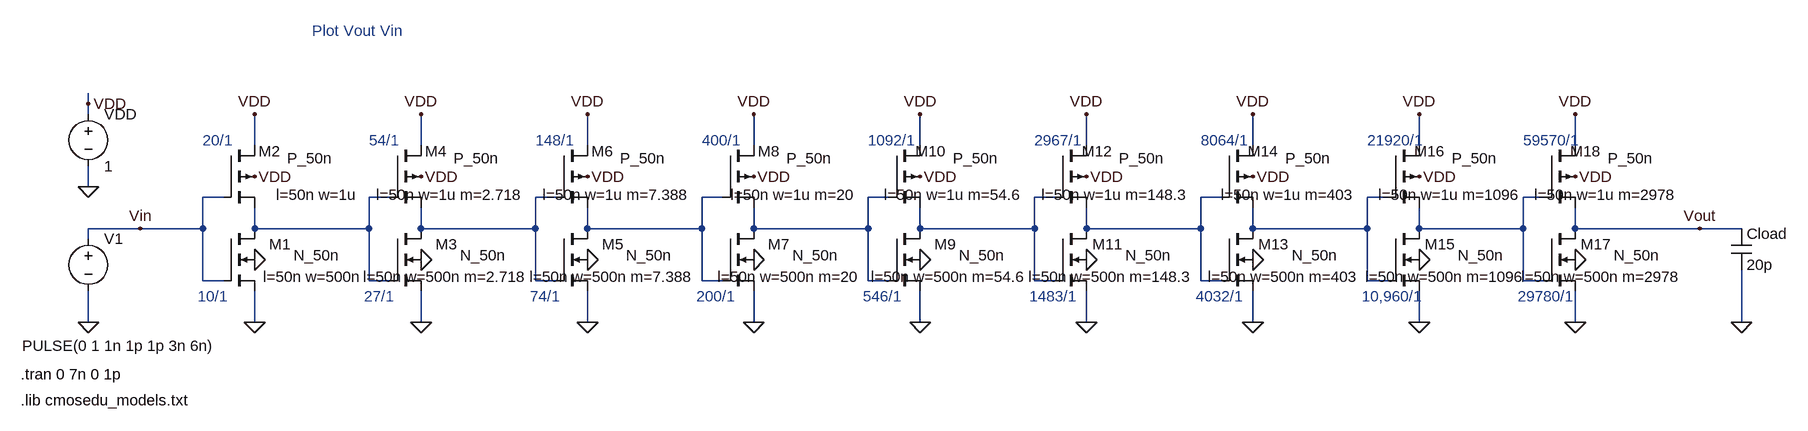
[diagram p0: schematic Fig11_20.asc]
Fig11_20.asc, the LTspice schematic file:
Version 4
SHEET 1 3172 680
WIRE 192 -368 192 -384
WIRE 192 -352 192 -368
WIRE 192 -240 192 -272
WIRE 192 -160 192 -176
WIRE 192 -32 192 -80
WIRE 272 -176 192 -176
WIRE 368 -176 272 -176
WIRE 368 -176 368 -224
WIRE 368 -96 368 -176
WIRE 400 -224 368 -224
WIRE 400 -96 368 -96
WIRE 448 -304 448 -352
WIRE 448 -176 448 -208
WIRE 448 -32 448 -80
WIRE 624 -176 448 -176
WIRE 624 -176 624 -224
WIRE 624 -96 624 -176
WIRE 656 -224 624 -224
WIRE 656 -96 624 -96
WIRE 704 -304 704 -352
WIRE 704 -176 704 -208
WIRE 704 -32 704 -80
WIRE 880 -176 704 -176
WIRE 880 -176 880 -224
WIRE 880 -96 880 -176
WIRE 912 -224 880 -224
WIRE 912 -96 880 -96
WIRE 960 -304 960 -352
WIRE 960 -176 960 -208
WIRE 960 -32 960 -80
WIRE 1136 -176 960 -176
WIRE 1136 -176 1136 -224
WIRE 1136 -96 1136 -176
WIRE 1168 -224 1136 -224
WIRE 1168 -96 1136 -96
WIRE 1216 -304 1216 -352
WIRE 1216 -176 1216 -208
WIRE 1216 -32 1216 -80
WIRE 1392 -176 1216 -176
WIRE 1392 -176 1392 -224
WIRE 1392 -96 1392 -176
WIRE 1424 -224 1392 -224
WIRE 1424 -96 1392 -96
WIRE 1472 -304 1472 -352
WIRE 1472 -176 1472 -208
WIRE 1472 -32 1472 -80
WIRE 1648 -176 1472 -176
WIRE 1648 -176 1648 -224
WIRE 1648 -96 1648 -176
WIRE 1680 -224 1648 -224
WIRE 1680 -96 1648 -96
WIRE 1728 -304 1728 -352
WIRE 1728 -176 1728 -208
WIRE 1728 -32 1728 -80
WIRE 1904 -176 1728 -176
WIRE 1904 -176 1904 -224
WIRE 1904 -96 1904 -176
WIRE 1936 -224 1904 -224
WIRE 1936 -96 1904 -96
WIRE 1984 -304 1984 -352
WIRE 1984 -176 1984 -208
WIRE 1984 -32 1984 -80
WIRE 2160 -176 1984 -176
WIRE 2160 -176 2160 -224
WIRE 2160 -96 2160 -176
WIRE 2192 -224 2160 -224
WIRE 2192 -96 2160 -96
WIRE 2240 -304 2240 -352
WIRE 2240 -176 2240 -208
WIRE 2240 -32 2240 -80
WIRE 2400 -176 2240 -176
WIRE 2400 -176 2400 -224
WIRE 2400 -96 2400 -176
WIRE 2432 -224 2400 -224
WIRE 2432 -96 2400 -96
WIRE 2480 -304 2480 -352
WIRE 2480 -176 2480 -208
WIRE 2480 -32 2480 -80
WIRE 2672 -176 2480 -176
WIRE 2736 -176 2672 -176
WIRE 2736 -32 2736 -112
FLAG 448 -128 0
FLAG 192 -240 0
FLAG 192 -368 VDD
FLAG 448 -256 VDD
FLAG 448 -32 0
FLAG 448 -352 VDD
FLAG 704 -128 0
FLAG 704 -256 VDD
FLAG 704 -32 0
FLAG 704 -352 VDD
FLAG 960 -128 0
FLAG 960 -256 VDD
FLAG 960 -32 0
FLAG 960 -352 VDD
FLAG 1216 -128 0
FLAG 1216 -256 VDD
FLAG 1216 -32 0
FLAG 1216 -352 VDD
FLAG 1472 -128 0
FLAG 1472 -256 VDD
FLAG 1472 -32 0
FLAG 1472 -352 VDD
FLAG 1728 -128 0
FLAG 1728 -256 VDD
FLAG 1728 -32 0
FLAG 1728 -352 VDD
FLAG 1984 -128 0
FLAG 1984 -256 VDD
FLAG 1984 -32 0
FLAG 1984 -352 VDD
FLAG 2240 -128 0
FLAG 2240 -256 VDD
FLAG 2240 -32 0
FLAG 2240 -352 VDD
FLAG 2480 -128 0
FLAG 2480 -256 VDD
FLAG 2480 -32 0
FLAG 2480 -352 VDD
FLAG 2736 -32 0
FLAG 192 -32 0
FLAG 2672 -176 Vout
FLAG 272 -176 Vin
SYMBOL nmos4 400 -176 R0
WINDOW 0 104 24 Right 0
WINDOW 3 179 41 Right 0
WINDOW 123 213 74 Right 0
SYMATTR InstName M1
SYMATTR Value N_50n
SYMATTR Value2 l=50n w=500n
SYMBOL voltage 192 -368 R0
WINDOW 123 0 0 Left 0
WINDOW 39 0 0 Left 0
SYMATTR InstName VDD
SYMATTR Value 1
SYMBOL pmos4 400 -304 R0
WINDOW 0 88 9 Right 0
WINDOW 3 168 20 Right 0
WINDOW 123 206 76 Right 0
SYMATTR InstName M2
SYMATTR Value P_50n
SYMATTR Value2 l=50n w=1u
SYMBOL nmos4 656 -176 R0
WINDOW 0 104 24 Right 0
WINDOW 3 179 41 Right 0
WINDOW 123 213 74 Right 0
SYMATTR InstName M3
SYMATTR Value N_50n
SYMATTR Value2 l=50n w=500n m=2.718
SYMBOL pmos4 656 -304 R0
WINDOW 0 88 9 Right 0
WINDOW 3 168 20 Right 0
WINDOW 123 206 76 Right 0
SYMATTR InstName M4
SYMATTR Value P_50n
SYMATTR Value2 l=50n w=1u m=2.718
SYMBOL nmos4 912 -176 R0
WINDOW 0 104 24 Right 0
WINDOW 3 179 41 Right 0
WINDOW 123 213 74 Right 0
SYMATTR InstName M5
SYMATTR Value N_50n
SYMATTR Value2 l=50n w=500n m=7.388
SYMBOL pmos4 912 -304 R0
WINDOW 0 88 9 Right 0
WINDOW 3 168 20 Right 0
WINDOW 123 206 76 Right 0
SYMATTR InstName M6
SYMATTR Value P_50n
SYMATTR Value2 l=50n w=1u m=7.388
SYMBOL nmos4 1168 -176 R0
WINDOW 0 104 24 Right 0
WINDOW 3 179 41 Right 0
WINDOW 123 213 74 Right 0
SYMATTR InstName M7
SYMATTR Value N_50n
SYMATTR Value2 l=50n w=500n m=20
SYMBOL pmos4 1168 -304 R0
WINDOW 0 88 9 Right 0
WINDOW 3 168 20 Right 0
WINDOW 123 206 76 Right 0
SYMATTR InstName M8
SYMATTR Value P_50n
SYMATTR Value2 l=50n w=1u m=20
SYMBOL nmos4 1424 -176 R0
WINDOW 0 104 24 Right 0
WINDOW 3 179 41 Right 0
WINDOW 123 213 74 Right 0
SYMATTR InstName M9
SYMATTR Value N_50n
SYMATTR Value2 l=50n w=500n m=54.6
SYMBOL pmos4 1424 -304 R0
WINDOW 0 88 9 Right 0
WINDOW 3 168 20 Right 0
WINDOW 123 206 76 Right 0
SYMATTR InstName M10
SYMATTR Value P_50n
SYMATTR Value2 l=50n w=1u m=54.6
SYMBOL nmos4 1680 -176 R0
WINDOW 0 104 24 Right 0
WINDOW 3 179 41 Right 0
WINDOW 123 213 74 Right 0
SYMATTR InstName M11
SYMATTR Value N_50n
SYMATTR Value2 l=50n w=500n m=148.3
SYMBOL pmos4 1680 -304 R0
WINDOW 0 88 9 Right 0
WINDOW 3 168 20 Right 0
WINDOW 123 206 76 Right 0
SYMATTR InstName M12
SYMATTR Value P_50n
SYMATTR Value2 l=50n w=1u m=148.3
SYMBOL nmos4 1936 -176 R0
WINDOW 0 104 24 Right 0
WINDOW 3 179 41 Right 0
WINDOW 123 213 74 Right 0
SYMATTR InstName M13
SYMATTR Value N_50n
SYMATTR Value2 l=50n w=500n m=403
SYMBOL pmos4 1936 -304 R0
WINDOW 0 88 9 Right 0
WINDOW 3 168 20 Right 0
WINDOW 123 206 76 Right 0
SYMATTR InstName M14
SYMATTR Value P_50n
SYMATTR Value2 l=50n w=1u m=403
SYMBOL nmos4 2192 -176 R0
WINDOW 0 104 24 Right 0
WINDOW 3 179 41 Right 0
WINDOW 123 213 74 Right 0
SYMATTR InstName M15
SYMATTR Value N_50n
SYMATTR Value2 l=50n w=500n m=1096
SYMBOL pmos4 2192 -304 R0
WINDOW 0 88 9 Right 0
WINDOW 3 168 20 Right 0
WINDOW 123 206 76 Right 0
SYMATTR InstName M16
SYMATTR Value P_50n
SYMATTR Value2 l=50n w=1u m=1096
SYMBOL nmos4 2432 -176 R0
WINDOW 0 104 24 Right 0
WINDOW 3 179 41 Right 0
WINDOW 123 213 74 Right 0
SYMATTR InstName M17
SYMATTR Value N_50n
SYMATTR Value2 l=50n w=500n m=2978
SYMBOL pmos4 2432 -304 R0
WINDOW 0 88 9 Right 0
WINDOW 3 168 20 Right 0
WINDOW 123 206 76 Right 0
SYMATTR InstName M18
SYMATTR Value P_50n
SYMATTR Value2 l=50n w=1u m=2978
SYMBOL cap 2720 -176 R0
SYMATTR InstName Cload
SYMATTR Value 20p
SYMBOL voltage 192 -176 R0
WINDOW 3 -102 180 Left 0
WINDOW 123 0 0 Left 0
WINDOW 39 0 0 Left 0
SYMATTR Value PULSE(0 1 1n 1p 1p 3n 6n)
SYMATTR InstName V1
TEXT 88 48 Left 0 !.tran 0 7n 0 1p
TEXT 88 88 Left 0 !.lib cmosedu_models.txt
TEXT 536 -480 Left 0 ;Plot Vout Vin
TEXT 368 -312 Left 0 ;20/1
TEXT 360 -72 Left 0 ;10/1
TEXT 624 -312 Left 0 ;54/1
TEXT 616 -72 Left 0 ;27/1
TEXT 880 -312 Left 0 ;148/1
TEXT 872 -72 Left 0 ;74/1
TEXT 1136 -312 Left 0 ;400/1
TEXT 1128 -72 Left 0 ;200/1
TEXT 1392 -312 Left 0 ;1092/1
TEXT 1384 -72 Left 0 ;546/1
TEXT 1648 -312 Left 0 ;2967/1
TEXT 1640 -72 Left 0 ;1483/1
TEXT 1904 -312 Left 0 ;8064/1
TEXT 1896 -72 Left 0 ;4032/1
TEXT 2160 -312 Left 0 ;21920/1
TEXT 2152 -72 Left 0 ;10,960/1
TEXT 2400 -312 Left 0 ;59570/1
TEXT 2392 -72 Left 0 ;29780/1

The netlist it stands for:
* Fig11_20.asc
M1 N001 Vin 0 0 N_50n l=50n w=500n
VDD VDD 0 1
M2 VDD Vin N001 VDD P_50n l=50n w=1u
M3 N002 N001 0 0 N_50n l=50n w=500n m=2.718
M4 VDD N001 N002 VDD P_50n l=50n w=1u m=2.718
M5 N003 N002 0 0 N_50n l=50n w=500n m=7.388
M6 VDD N002 N003 VDD P_50n l=50n w=1u m=7.388
M7 N004 N003 0 0 N_50n l=50n w=500n m=20
M8 VDD N003 N004 VDD P_50n l=50n w=1u m=20
M9 N005 N004 0 0 N_50n l=50n w=500n m=54.6
M10 VDD N004 N005 VDD P_50n l=50n w=1u m=54.6
M11 N006 N005 0 0 N_50n l=50n w=500n m=148.3
M12 VDD N005 N006 VDD P_50n l=50n w=1u m=148.3
M13 N007 N006 0 0 N_50n l=50n w=500n m=403
M14 VDD N006 N007 VDD P_50n l=50n w=1u m=403
M15 N008 N007 0 0 N_50n l=50n w=500n m=1096
M16 VDD N007 N008 VDD P_50n l=50n w=1u m=1096
M17 Vout N008 0 0 N_50n l=50n w=500n m=2978
M18 VDD N008 Vout VDD P_50n l=50n w=1u m=2978
Cload Vout 0 20p
V1 Vin 0 PULSE(0 1 1n 1p 1p 3n 6n)
.model NMOS NMOS
.model PMOS PMOS
.lib standard.mos
.tran 0 7n 0 1p
.lib cmosedu_models.txt
* Plot Vout Vin
* 20/1
* 10/1
* 54/1
* 27/1
* 148/1
* 74/1
* 400/1
* 200/1
* 1092/1
* 546/1
* 2967/1
* 1483/1
* 8064/1
* 4032/1
* 21920/1
* 10,960/1
* 59570/1
* 29780/1
.backanno
.end